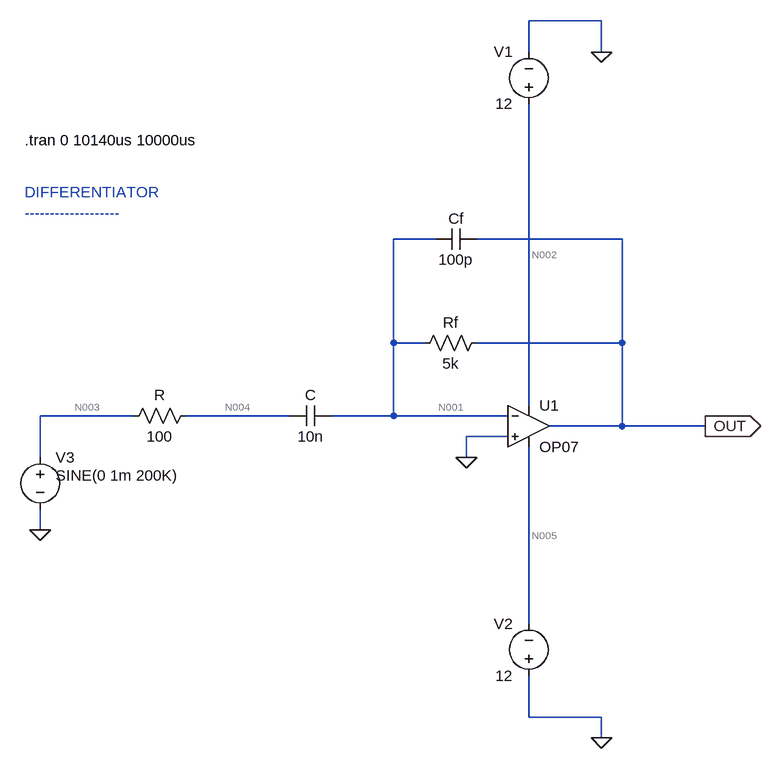
[diagram p0: schematic Op_amp_as_DIFFERENTIATOR_with_AC_input_at_freq_greater_than_cutoff_freq.asc]
Op_amp_as_DIFFERENTIATOR_with_AC_input_at_freq_greater_than_cutoff_freq.asc, the LTspice schematic file:
Version 4.1
SHEET 1 3496 1680
WIRE 192 -544 80 -544
WIRE 80 -496 80 -544
WIRE 192 -496 192 -544
WIRE -64 -208 -128 -208
WIRE 224 -208 0 -208
WIRE -128 -48 -128 -208
WIRE -80 -48 -128 -48
WIRE 224 -48 224 -208
WIRE 224 -48 0 -48
WIRE 80 48 80 -416
WIRE -528 64 -672 64
WIRE -288 64 -448 64
WIRE -128 64 -128 -48
WIRE -128 64 -224 64
WIRE 48 64 -128 64
WIRE 224 80 224 -48
WIRE 224 80 112 80
WIRE 352 80 224 80
WIRE 48 96 -16 96
WIRE -672 128 -672 64
WIRE -16 128 -16 96
WIRE -672 240 -672 208
WIRE 80 384 80 112
WIRE 80 528 80 464
WIRE 192 528 80 528
WIRE 192 560 192 528
FLAG 192 -496 0
FLAG 192 560 0
FLAG -672 240 0
FLAG 352 80 OUT
IOPIN 352 80 Out
FLAG -16 128 0
SYMBOL voltage 80 -400 R180
WINDOW 0 24 96 Left 2
WINDOW 3 24 16 Left 2
WINDOW 123 0 0 Left 0
WINDOW 39 0 0 Left 0
SYMATTR InstName V1
SYMATTR Value 12
SYMBOL voltage 80 480 R180
WINDOW 0 24 96 Left 2
WINDOW 3 24 16 Left 2
WINDOW 123 0 0 Left 0
WINDOW 39 0 0 Left 0
SYMATTR InstName V2
SYMATTR Value 12
SYMBOL OpAmps\\OP07 80 16 R0
SYMATTR InstName U1
SYMBOL res -432 48 R90
WINDOW 0 0 56 VBottom 2
WINDOW 3 32 56 VTop 2
SYMATTR InstName R
SYMATTR Value 100
SYMBOL voltage -672 112 R0
WINDOW 123 0 0 Left 0
WINDOW 39 0 0 Left 0
WINDOW 3 24 44 Left 2
SYMATTR Value SINE(0 1m 200K)
SYMATTR InstName V3
SYMBOL cap -224 48 R90
WINDOW 0 0 32 VBottom 2
WINDOW 3 32 32 VTop 2
SYMATTR InstName C
SYMATTR Value 10n
SYMBOL res 16 -64 R90
WINDOW 0 0 56 VBottom 2
WINDOW 3 32 56 VTop 2
SYMATTR InstName Rf
SYMATTR Value 5k
SYMBOL cap 0 -224 R90
WINDOW 0 0 32 VBottom 2
WINDOW 3 32 32 VTop 2
SYMATTR InstName Cf
SYMATTR Value 100p
TEXT -696 -360 Left 2 !.tran 0 10140us 10000us
TEXT -696 -280 Left 2 ;DIFFERENTIATOR\n-------------------

The netlist it stands for:
* Op_amp_as_DIFFERENTIATOR_with_AC_input_at_freq_greater_than_cutoff_freq.asc
V1 N002 0 12
V2 0 N005 12
X§U1 0 N001 N002 N005 OUT LT1001  ; OP07, pins In+ In- V+ V- OUT
R N004 N003 100
V3 N003 0 SINE(0 1m 200K)
C N001 N004 10n
Rf OUT N001 5k
Cf OUT N001 100p
.tran 0 10140us 10000us
* DIFFERENTIATOR
* -------------------
.lib LTC.lib
.backanno
.end

* Results of the author's LTspice run, read from the files saved beside the schematic
* Operating Point, zero values left out:
*   V(n005) = -12 V
*   V(n002) = 12 V
*   I(V1) = -2.25 mA
*   I(V2) = -2.25 mA
*   Ix(u1:3) = 2.25 mA
*   Ix(u1:4) = -2.25 mA
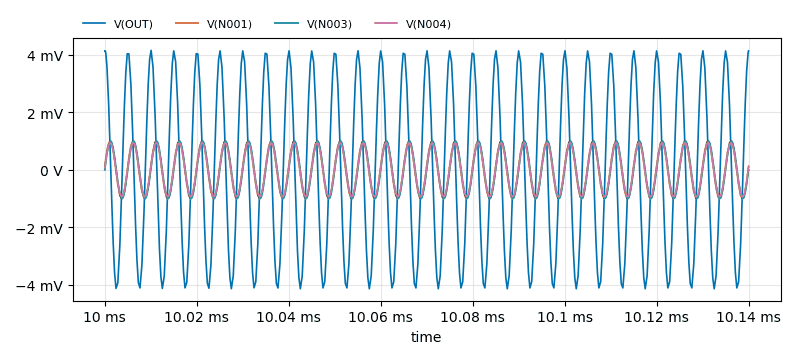
[diagram p1: Transient Analysis of Op_amp_as_DIFFERENTIATOR_with_AC_input_at_freq_greater_than_cutoff_freq.asc, plotted from the saved traces]
* Transient Analysis, 1 run:
*   V(OUT): min -4.133 mV, max 4.147 mV, average 27.56 nV, rms 2.912 mV, last 4.13 mV
*   V(N001): min -1 mV, max 999.7 µV, average -5.115 nV, rms 708.6 µV, last 122.4 µV
*   V(N003): min -1 mV, max 999.9 µV, average 50.11 nV, rms 710.8 µV, last 0 V
*   V(N004): min -938.5 µV, max 938.5 µV, average 51.05 nV, rms 666.1 µV, last 71.3 µV